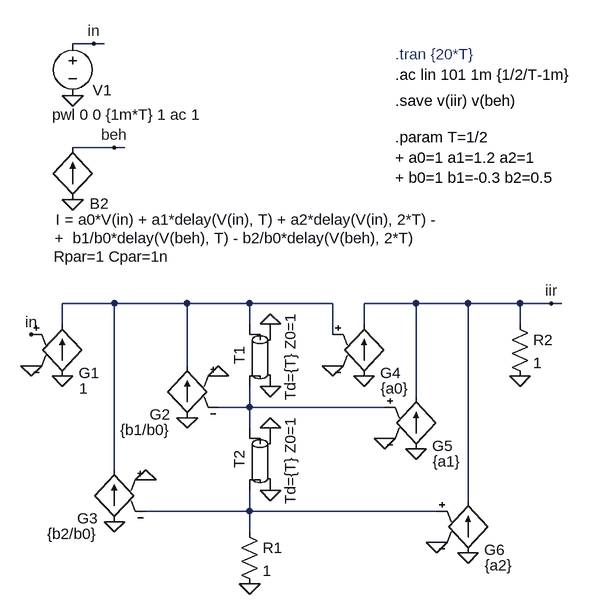
[diagram p0: schematic 2nd_iir.asc]
2nd_iir.asc, the LTspice schematic file:
Version 4
SHEET 1 1564 744
WIRE -48 -320 -80 -320
WIRE -32 -320 -48 -320
WIRE -16 -160 -80 -160
WIRE 0 -160 -16 -160
WIRE -16 80 -96 80
WIRE 96 80 -16 80
WIRE 192 80 96 80
WIRE 320 80 192 80
WIRE 448 80 368 80
WIRE 528 80 448 80
WIRE 608 80 528 80
WIRE 656 80 608 80
WIRE 672 80 656 80
WIRE -96 112 -96 80
WIRE 192 112 192 80
WIRE 368 112 368 80
WIRE 608 112 608 80
WIRE 320 128 320 80
WIRE 96 176 96 80
WIRE 448 224 448 80
WIRE 192 240 192 208
WIRE 192 240 144 240
WIRE 400 240 192 240
WIRE 192 272 192 240
WIRE -16 336 -16 80
WIRE 528 384 528 80
WIRE 192 400 192 368
WIRE 192 400 32 400
WIRE 480 400 192 400
WIRE 192 432 192 400
FLAG 224 208 0
FLAG 224 112 0
FLAG 224 368 0
FLAG 224 272 0
FLAG -96 192 0
FLAG -144 176 0
FLAG -144 128 in
FLAG 192 512 0
FLAG 608 192 0
FLAG 96 256 0
FLAG 144 192 0
FLAG -16 416 0
FLAG 32 352 0
FLAG 368 192 0
FLAG 320 176 0
FLAG 448 304 0
FLAG 400 288 0
FLAG 528 464 0
FLAG 480 448 0
FLAG -80 -240 0
FLAG -48 -320 in
FLAG 656 80 iir
FLAG -80 -80 0
FLAG -16 -160 beh
SYMBOL tline 208 160 M90
WINDOW 3 1 31 Top 2
SYMATTR Value Td={T} Z0=1
SYMATTR InstName T1
SYMBOL tline 208 320 M90
WINDOW 3 1 31 Top 2
SYMATTR Value Td={T} Z0=1
SYMATTR InstName T2
SYMBOL g -96 96 R0
WINDOW 0 25 91 Left 2
WINDOW 3 26 115 Left 2
SYMATTR InstName G1
SYMATTR Value 1
SYMBOL res 176 416 R0
SYMATTR InstName R1
SYMATTR Value 1
SYMBOL res 592 96 R0
SYMATTR InstName R2
SYMATTR Value 1
SYMBOL g 96 160 M0
WINDOW 0 25 91 Left 2
WINDOW 3 26 115 Left 2
SYMATTR InstName G2
SYMATTR Value {b1/b0}
SYMBOL g -16 320 M0
WINDOW 0 25 91 Left 2
WINDOW 3 26 115 Left 2
SYMATTR InstName G3
SYMATTR Value {b2/b0}
SYMBOL g 368 96 R0
WINDOW 0 25 91 Left 2
WINDOW 3 26 115 Left 2
SYMATTR InstName G4
SYMATTR Value {a0}
SYMBOL g 448 208 R0
WINDOW 0 25 91 Left 2
WINDOW 3 26 115 Left 2
SYMATTR InstName G5
SYMATTR Value {a1}
SYMBOL g 528 368 R0
WINDOW 0 25 91 Left 2
WINDOW 3 26 115 Left 2
SYMATTR InstName G6
SYMATTR Value {a2}
SYMBOL voltage -80 -336 R0
WINDOW 0 31 88 Left 2
WINDOW 3 -32 125 Left 2
SYMATTR InstName V1
SYMATTR Value pwl 0 0 {1m*T} 1 ac 1
SYMBOL bi2 -80 -160 R0
WINDOW 0 26 86 Left 2
WINDOW 3 -26 111 Left 2
WINDOW 123 -28 139 Left 2
WINDOW 39 -29 168 Left 2
SYMATTR InstName B2
SYMATTR Value I = a0*V(in) + a1*delay(V(in), T) + a2*delay(V(in), 2*T) -
SYMATTR Value2 +  b1/b0*delay(V(beh), T) - b2/b0*delay(V(beh), 2*T)
SYMATTR SpiceLine Rpar=1 Cpar=1n
TEXT 416 -176 Left 2 !.param T=1/2\n+ a0=1 a1=1.2 a2=1\n+ b0=1 b1=-0.3 b2=0.5
TEXT 416 -272 Left 2 !.ac lin 101 1m {1/2/T-1m}
TEXT 416 -304 Left 2 ;.tran {20*T}
TEXT 416 -232 Left 2 !.save v(iir) v(beh)

The netlist it stands for:
* 2nd_iir.asc
T1 N001 0 N002 0 Td={T} Z0=1
T2 N002 0 N003 0 Td={T} Z0=1
G1 0 N001 in 0 1
R1 N003 0 1
R2 iir 0 1
G2 0 N001 0 N002 {b1/b0}
G3 0 N001 0 N003 {b2/b0}
G4 0 iir N001 0 {a0}
G5 0 iir N002 0 {a1}
G6 0 iir N003 0 {a2}
V1 in 0 pwl 0 0 {1m*T} 1 ac 1
B2 0 beh I = a0*V(in) + a1*delay(V(in), T) + a2*delay(V(in), 2*T) - +  b1/b0*delay(V(beh), T) - b2/b0*delay(V(beh), 2*T) Rpar=1 Cpar=1n
.param T=1/2
+ a0=1 a1=1.2 a2=1
+ b0=1 b1=-0.3 b2=0.5
.ac lin 101 1m {1/2/T-1m}
* .tran {20*T}
.save v(iir) v(beh)
.backanno
.end